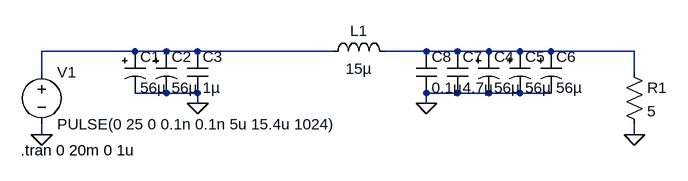
[diagram p0: schematic SpuleSchaltregler.asc]
SpuleSchaltregler.asc, the LTspice schematic file:
Version 4
SHEET 1 880 680
WIRE -128 160 -272 160
WIRE -80 160 -128 160
WIRE -32 160 -80 160
WIRE 176 160 -32 160
WIRE 320 160 256 160
WIRE 368 160 320 160
WIRE 416 160 368 160
WIRE 464 160 416 160
WIRE 512 160 464 160
WIRE 640 160 512 160
WIRE -272 192 -272 160
WIRE 640 192 640 160
WIRE -80 224 -128 224
WIRE -32 224 -80 224
WIRE 368 224 320 224
WIRE 416 224 368 224
WIRE 464 224 416 224
WIRE 512 224 464 224
WIRE -32 240 -32 224
WIRE 320 240 320 224
WIRE -272 288 -272 272
WIRE 640 288 640 272
FLAG -272 288 0
FLAG 640 288 0
FLAG -32 240 0
FLAG 320 240 0
SYMBOL ind 160 176 R270
WINDOW 0 32 56 VTop 2
WINDOW 3 5 56 VBottom 2
SYMATTR InstName L1
SYMATTR Value 15µ
SYMATTR SpiceLine Ipk=15.5 Rser=0.0169 Rpar=1413 Cpar=0 mfg="Coilcraft" pn="XAL1010-153"
SYMBOL res 624 176 R0
SYMATTR InstName R1
SYMATTR Value 5
SYMATTR SpiceLine tol=1 pwr=0.5
SYMBOL voltage -272 176 R0
WINDOW 123 0 0 Left 2
WINDOW 39 0 0 Left 2
SYMATTR InstName V1
SYMATTR Value PULSE(0 25 0 0.1n 0.1n 5u 15.4u 1024)
SYMBOL polcap -144 160 R0
WINDOW 3 24 56 Left 2
SYMATTR Value 56µ
SYMATTR InstName C1
SYMATTR Description Capacitor
SYMATTR Type cap
SYMATTR SpiceLine V=35 Irms=290m Rser=0.3 Lser=0 mfg="Panasonic" pn="ECA1VFQ560" type="Al electrolytic"
SYMBOL polcap -96 160 R0
WINDOW 3 24 56 Left 2
SYMATTR Value 56µ
SYMATTR InstName C2
SYMATTR Description Capacitor
SYMATTR Type cap
SYMATTR SpiceLine V=16 Irms=175m Rser=0.65 Lser=0 mfg="Panasonic" pn="ECA1CFQ560" type="Al electrolytic"
SYMBOL cap -48 160 R0
SYMATTR InstName C3
SYMATTR Value 1µ
SYMATTR SpiceLine V=50 Irms=3.41 Rser=0.0133158 Lser=0 mfg="KEMET" pn="C1206C105K5RAC" type="X7R"
SYMBOL cap 352 160 R0
SYMATTR InstName C7
SYMATTR Value 4.7µ
SYMATTR SpiceLine V=50 Irms=15 Rser=0.00481132 Lser=0 mfg="KEMET" pn="C1210C475K5RAC" type="X7R"
SYMBOL cap 304 160 R0
SYMATTR InstName C8
SYMATTR Value 0.1µ
SYMATTR SpiceLine V=50 Irms=1.02 Rser=0.0850352 Lser=0 mfg="KEMET" pn="C1206F104K5RAC" type="X7R"
SYMBOL polcap 400 160 R0
WINDOW 3 24 56 Left 2
SYMATTR Value 56µ
SYMATTR InstName C4
SYMATTR Description Capacitor
SYMATTR Type cap
SYMATTR SpiceLine V=16 Irms=175m Rser=0.65 Lser=0 mfg="Panasonic" pn="ECA1CFQ560" type="Al electrolytic"
SYMBOL polcap 448 160 R0
WINDOW 3 24 56 Left 2
SYMATTR Value 56µ
SYMATTR InstName C5
SYMATTR Description Capacitor
SYMATTR Type cap
SYMATTR SpiceLine V=16 Irms=175m Rser=0.65 Lser=0 mfg="Panasonic" pn="ECA1CFQ560" type="Al electrolytic"
SYMBOL polcap 496 160 R0
WINDOW 3 24 56 Left 2
SYMATTR Value 56µ
SYMATTR InstName C6
SYMATTR Description Capacitor
SYMATTR Type cap
SYMATTR SpiceLine V=16 Irms=175m Rser=0.65 Lser=0 mfg="Panasonic" pn="ECA1CFQ560" type="Al electrolytic"
TEXT -304 312 Left 2 !.tran 0 20m 0 1u

The netlist it stands for:
* SpuleSchaltregler.asc
L1 N001 N002 15µ Ipk=15.5 Rser=0.0169 Rpar=1413 Cpar=0 mfg="Coilcraft" pn="XAL1010-153"
R1 N002 0 5 tol=1 pwr=0.5
V1 N001 0 PULSE(0 25 0 0.1n 0.1n 5u 15.4u 1024)
C1 N001 0 56µ V=35 Irms=290m Rser=0.3 Lser=0 mfg="Panasonic" pn="ECA1VFQ560" type="Al electrolytic"
C2 N001 0 56µ V=16 Irms=175m Rser=0.65 Lser=0 mfg="Panasonic" pn="ECA1CFQ560" type="Al electrolytic"
C3 N001 0 1µ V=50 Irms=3.41 Rser=0.0133158 Lser=0 mfg="KEMET" pn="C1206C105K5RAC" type="X7R"
C7 N002 0 4.7µ V=50 Irms=15 Rser=0.00481132 Lser=0 mfg="KEMET" pn="C1210C475K5RAC" type="X7R"
C8 N002 0 0.1µ V=50 Irms=1.02 Rser=0.0850352 Lser=0 mfg="KEMET" pn="C1206F104K5RAC" type="X7R"
C4 N002 0 56µ V=16 Irms=175m Rser=0.65 Lser=0 mfg="Panasonic" pn="ECA1CFQ560" type="Al electrolytic"
C5 N002 0 56µ V=16 Irms=175m Rser=0.65 Lser=0 mfg="Panasonic" pn="ECA1CFQ560" type="Al electrolytic"
C6 N002 0 56µ V=16 Irms=175m Rser=0.65 Lser=0 mfg="Panasonic" pn="ECA1CFQ560" type="Al electrolytic"
.tran 0 20m 0 1u
.backanno
.end